# EAGLE design lora-tester (EAGLE 8.4.0)
AUTHOR: Adam Horcica; TITLE: LoRaWAN Tester; VERSION: 0.1
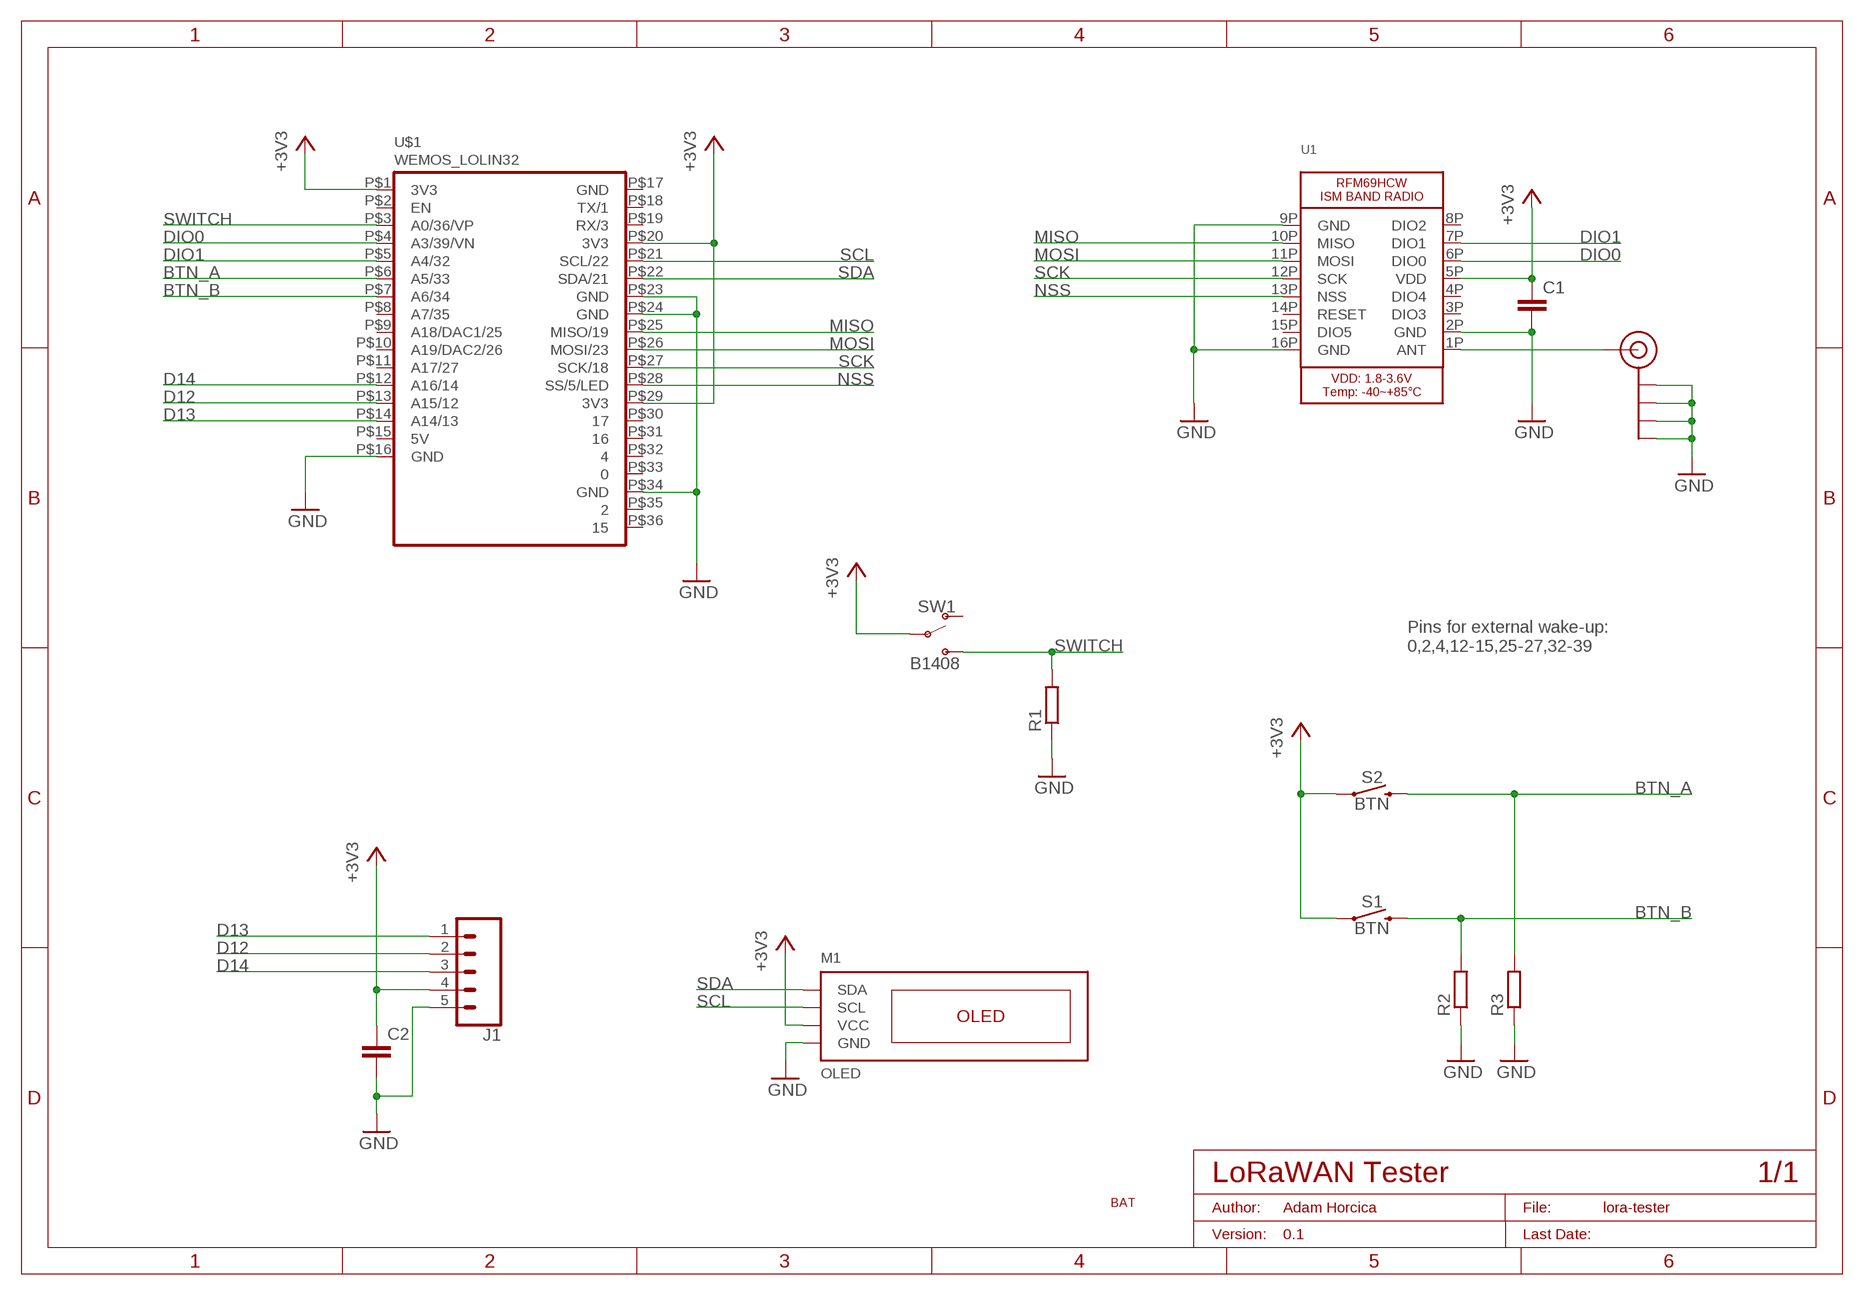
[diagram p0: schematic, sheet 1]

## Parts
BAT  BAT  [BAT]
C1  C-EUC1206  [C1206]
C2  C-EUC1206  [C1206]
J1  CONN_05PTH_LONGPADS  [1X05_LONGPADS]
J$2  SMA_EDGE  [SMA-EDGE]
M1  OLED  [OLED]
R1  R-EU_R0805  [R0805]
R2  R-EU_R0805  [R0805]
R3  R-EU_R0805  [R0805]
S1  BTN  MOMENTARY-SWITCH-SPST-SMD-6.2MM-TALL  [TACTILE_SWITCH_SMD_6.2MM_TALL]
S2  BTN  MOMENTARY-SWITCH-SPST-SMD-6.2MM-TALL  [TACTILE_SWITCH_SMD_6.2MM_TALL]
SW1  B1408  SL19-121P-B1408  [P-B1408]
U1  RFM69HCW_SMT  [RFMHCW_SMT]
U$1  WEMOS_LOLIN32  [WEMOS_LOLIN32]

## Nets
+3V3: C1.1 C2.1 J1.4 M1.VCC S1.A2 S2.A2 SW1.P U1.5P(VDD) U$1.P$1(3V3) U$1.P$20(3V3) U$1.P$29(3V3)
BTN_A: R3.2 S2.B2 U$1.P$6(A5/33)
BTN_B: R2.2 S1.B2 U$1.P$7(A6/34)
D12: J1.2 U$1.P$13(A15/12)
D13: J1.1 U$1.P$14(A14/13)
D14: J1.3 U$1.P$12(A16/14)
DIO0: U1.6P(DIO0) U$1.P$4(A3/39/VN)
DIO1: U1.7P(DIO1) U$1.P$5(A4/32)
GND: C1.2 C2.2 J1.5 J$2.GND@0(GND) J$2.GND@1(GND) J$2.GND@2(GND) J$2.GND@3(GND) M1.GND R1.1 R2.1 R3.1 U1.2P(GND) U1.9P(GND) U1.16P(GND) U$1.P$16(GND) U$1.P$23(GND) U$1.P$24(GND) U$1.P$34(GND)
MISO: U1.10P(MISO) U$1.P$25(MISO/19)
MOSI: U1.11P(MOSI) U$1.P$26(MOSI/23)
N$3: J$2.SIG(SIGNAL) U1.1P(ANT)
NSS: U1.13P(NSS) U$1.P$28(SS/5/LED)
SCK: U1.12P(SCK) U$1.P$27(SCK/18)
SCL: M1.SCL U$1.P$21(SCL/22)
SDA: M1.SDA U$1.P$22(SDA/21)
SWITCH: R1.2 SW1.S U$1.P$3(A0/36/VP)
Unconnected: SW1.O U1.3P(DIO3) U1.4P(DIO4) U1.8P(DIO2) U1.14P(RESET) U1.15P(DIO5) U$1.P$2(EN) U$1.P$8(A7/35) U$1.P$9(A18/DAC1/25) U$1.P$10(A19/DAC2/26) U$1.P$11(A17/27) U$1.P$15(5V) U$1.P$17(GND) U$1.P$18(TX/1) U$1.P$19(RX/3) U$1.P$30 U$1.P$31 U$1.P$32 U$1.P$33 U$1.P$35 U$1.P$36

## Notes on the sheet
- Pins for external wake-up:
  0,2,4,12-15,25-27,32-39

## Library data of the parts
BAT = modules:BAT
C1 C2 = rcl:C-EU: CAPACITOR, European symbol
J1 = modules:CONN_05: Multi connection point. Often used as Generic Header-pin footprint for 0.1 inch spaced/style header connections On any of the 0.1 inch spaced packages, you can populate with these: Break Away Headers - Straight <https://www.sparkfun.com/products/116> (PRT-00116) Break Away Male Headers - Right Angle <https://www.sparkfun.com/products/553> (PRT-00553) Female Headers <https://www.sparkfun.com/products/115> (PRT-00115) Break Away Headers - Machine Pin <https://www.sparkfun.com/products/117> (PRT-00117) Break Away Female Headers - Swiss Machine Pin <https://www.sparkfun.com/products/743> (PRT-00743) For SCREWTERMINALS and SPRING TERMINALS visit here: Screw Terimnals on SparkFun.com <https://www.sparkfun.com/search/results?term=Screw+Terminals> (5mm/3.5mm/2.54mm spacing) This device is also useful as a general connection point to wire up your design to another part of your project. Our various solder wires solder well into these plated through hole pads. Hook-Up Wire - Assortment (Stranded, 22 AWG) <https://www.sparkfun.com/products/11375> (PRT-11375) Hook-Up Wire - Assortment (Solid Core, 22 AWG) <https://www.sparkfun.com/products/11367> (PRT-11367) View the entire wire category on our website here <https://www.sparkfun.com/categories/141> Special notes: Molex polarized connector foot print use with SKU : PRT-08231 with associated crimp pins and housings. 1MM SMD Version SKU: PRT-10208
J$2 = modules:SMA_EDGE: SMA Antenna Connector End launch SMA connector. The paste layer has been removed so that the connector can be hand soldered onto the board after reflow.
M1 = modules:OLED
R1-R3 = rcl:R-EU_: RESISTOR, European symbol
S1 S2 = SparkFun-Switches:MOMENTARY-SWITCH-SPST: Momentary Switch (Pushbutton) - SPST Normally-open (NO) SPST momentary switches (buttons, pushbuttons). Variants PTH-12MM - 12mm square, through-hole Momentary Pushbutton Switch - 12mm Square <https://www.sparkfun.com/products/9190> (COM-09190) PTH-6.0MM, PTH-6.0MM-KIT - 6.0mm square, through-hole Mini Pushbutton Switch <https://www.sparkfun.com/products/97> (COM-00097) KIT package intended for soldering kit's - only one side of pads' copper is exposed. PTH-RIGHT-ANGLE-KIT - Right-angle, through-hole Right Angle Tactile Button <https://www.sparkfun.com/products/10791> - Used on SparkFun BigTime Watch Kit <https://www.sparkfun.com/products/11734> SMD-12MM - 12mm square, surface-mount Tactile Button - SMD (12mm) <https://www.sparkfun.com/products/12993> (COM-12993) Used on SparkFun PicoBoard <https://www.sparkfun.com/products/11888> SMD-4.5MM - 4.5mm Square Trackball Switch Used on SparkFun Blackberry Trackballer Breakout <https://www.sparkfun.com/products/13169> SMD-4.6MMX2.8MM - 4.60mm x 2.80mm, surface mount Used on SparkFun SAMD21 Mini Breakout <https://www.sparkfun.com/products/13664> SMD-5.2MM, SMD-5.2-REDUNDANT - 5.2mm square, surface-mount Mini Pushbutton Switch - SMD <https://www.sparkfun.com/products/8720> (COM-08720) Used on Arduino Pro Mini <https://www.sparkfun.com/products/11114> REDUNDANT package connects both switch circuits together SMD-6.0X3.5MM - 6.0 x 3.5mm, surface mount Momentary Reset Switch SMD <https://www.sparkfun.com/products/8229> (COM-08229) SMD-6.2MM-TALL - 6.2mm square, surface mount Tactile Button - SMD (6mm) <https://www.sparkfun.com/products/12992> Used on SparkFun Digital Sandbox <https://www.sparkfun.com/products/12651> SMD-RIGHT-ANGLE - Right-angle, surface mount Used on SparkFun Block for Intel® Edison - Arduino <https://www.sparkfun.com/products/13036>; PROD_ID: SWCH-11966; SF_SKU: COM-12992
SW1 = modules:SL19-121
U1 = Adafruit RFM+LoRa Breakout:RFM69HCW: RFM69HCW - ISM Band RF Transceiver
U$1 = modules:WEMOS_LOLIN32

## Board
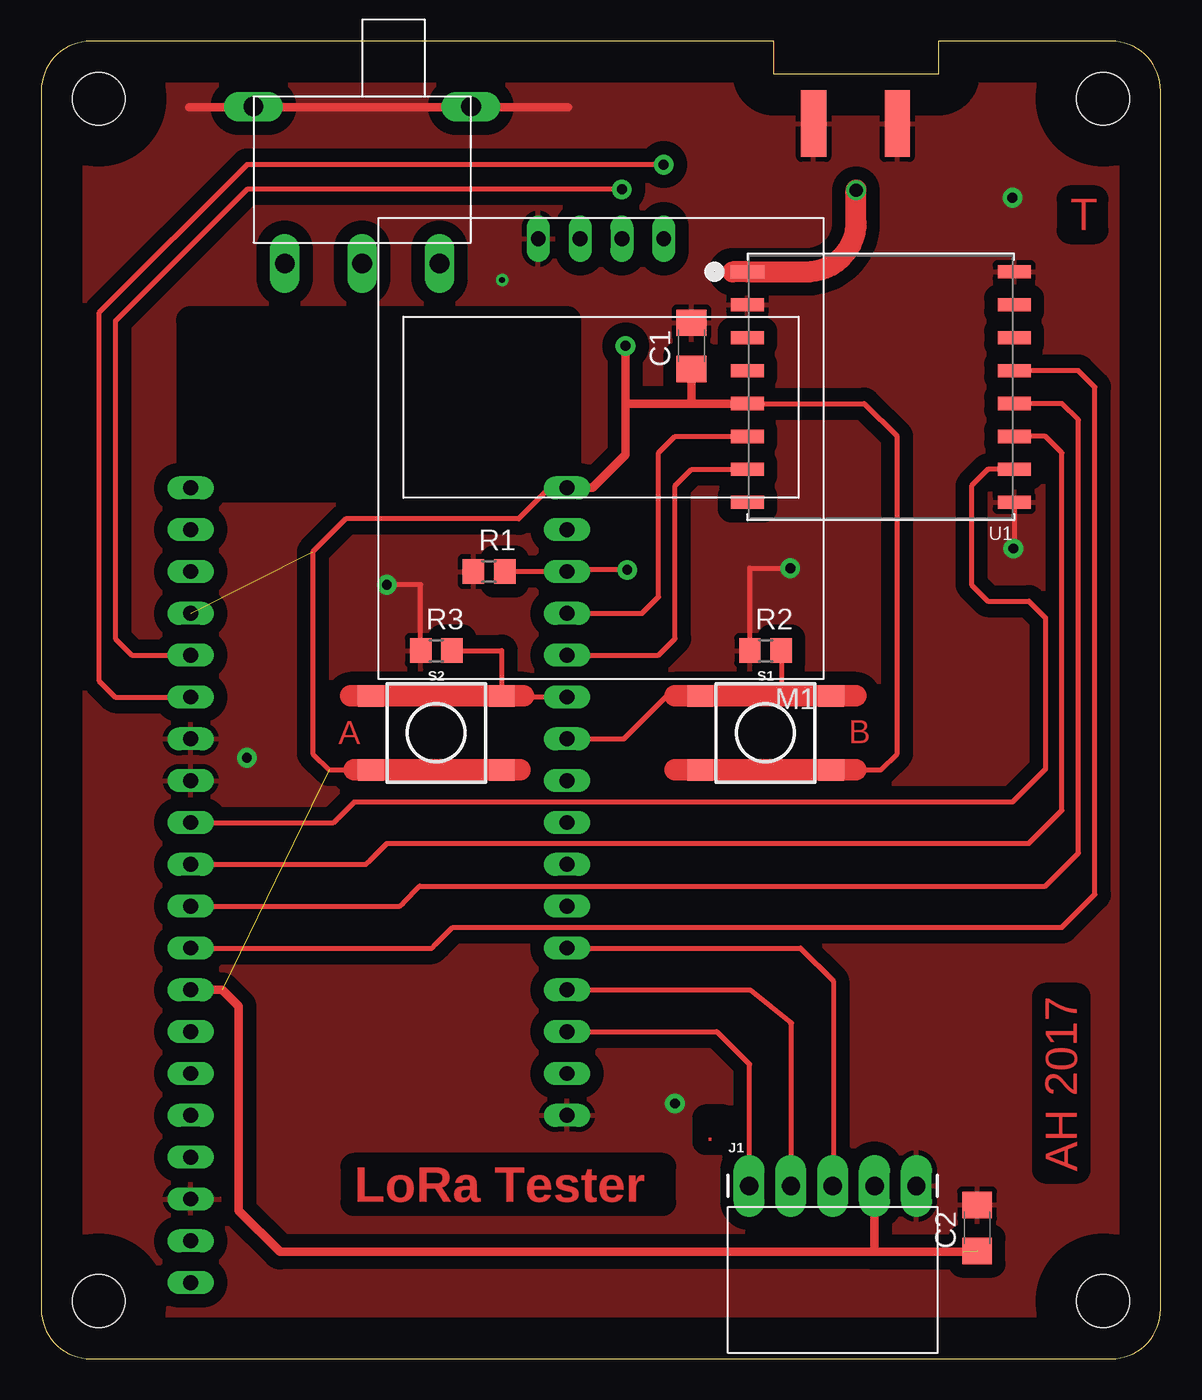
[diagram p1: board, top side]
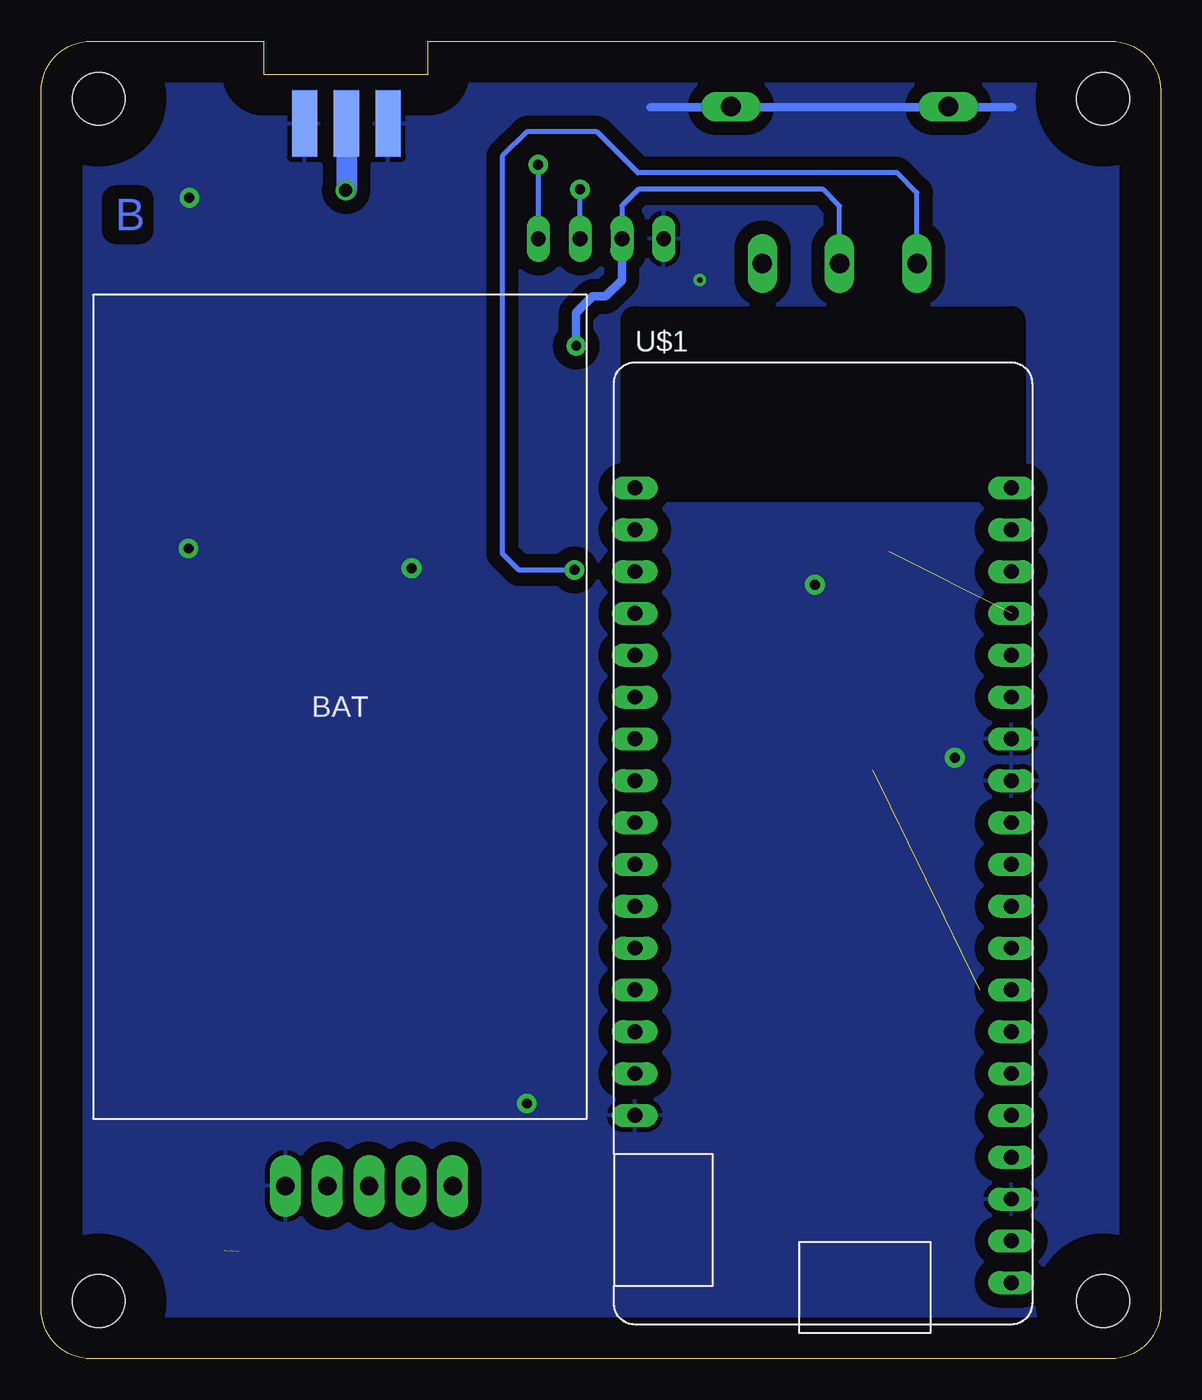
[diagram p2: board, bottom side, seen from below]

Size 68 x 80 mm. Coordinates in mm from the lower left corner, seen from the top.
Outline: 68,3 68,77 arc90 65,80 54.5,80 54.5,78 44.5,78 44.5,80 3,80 arc90 0,77 0,3 arc90 3,0 65,0 arc90 68,3
Copper layers (1*16): Top 0.035mm / dielectric 1.5mm / Bottom 0.035mm
Design rules "default *": minimum track width 6mil, minimum drill 0.35mm, track to track 10mil, track to pad 10mil, pad to pad 10mil, via to via 10mil, smd to smd 10mil, copper to edge 2.5mm, drill to drill 10mil, minimum pad ring 10mil, minimum via ring 8mil, stop-mask expansion 4mil, vias tented up to drill 0mil, thermal gap 0.3mm
Holes 3.2 mm at 3.5,3.5 64.5,3.5 3.5,76.5 64.5,76.5

### Footprints (pad centres in the part's own frame; a part is rotated, then mirrored left to right if it is on the bottom)
C1206 = smd 1.6 x 1.8: 1 -1.4,0; 2 1.4,0
1X05_LONGPADS = drill 1.118 pad 1.88 long: 1 0,0; 2 2.54,0; 3 5.08,0; 4 7.62,0; 5 10.16,0
SMA-EDGE = smd 1.524 x 4.064: GND@0 0,0; GND@1 5.08,0; SIG 2.54,0 | smd 1.524 x 4.064 bottom: GND@2 0,0; GND@3 5.08,0
OLED = drill 0.9 long: GND 3.81,0; SCL -1.27,0; SDA -3.81,0; VCC 1.27,0
R0805 = smd 1.3 x 1.5: 1 -0.95,0; 2 0.95,0
TACTILE_SWITCH_SMD_6.2MM_TALL = smd 1.55 x 1.3: A1 -3.975,-2.25; A2 3.975,-2.25; B1 -3.975,2.25; B2 3.975,2.25
P-B1408 = drill 1.2 long: GND@1 -6.605,-9.53; GND@2 6.605,-9.53; O -4.7,0; P 0,0; S 4.7,0
RFMHCW_SMT = smd 2 x 0.8: 1P 8.1,-7; 2P 8.1,-5; 3P 8.1,-3; 4P 8.1,-1; 5P 8.1,1; 6P 8.1,3; 7P 8.1,5; 8P 8.1,7; 9P -8.1,7; 10P -8.1,5; 11P -8.1,3; 12P -8.1,1; 13P -8.1,-1; 14P -8.1,-3; 15P -8.1,-5; 16P -8.1,-7
WEMOS_LOLIN32 = drill 0.9 long: P$1 -12.7,19.05; P$2 -12.7,16.51; P$3 -12.7,13.97; P$4 -12.7,11.43; P$5 -12.7,8.89; P$6 -12.7,6.35; P$7 -12.7,3.81; P$8 -12.7,1.27; P$9 -12.7,-1.27; P$10 -12.7,-3.81; P$11 -12.7,-6.35; P$12 -12.7,-8.89; P$13 -12.7,-11.43; P$14 -12.7,-13.97; P$15 -12.7,-16.51; P$16 -12.7,-19.05; P$17 10.16,19.05; P$18 10.16,16.51; P$19 10.16,13.97; P$20 10.16,11.43; P$21 10.16,8.89; P$22 10.16,6.35; P$23 10.16,3.81; P$24 10.16,1.27; P$25 10.16,-1.27; P$26 10.16,-3.81; P$27 10.16,-6.35; P$28 10.16,-8.89; P$29 10.16,-11.43; P$30 10.16,-13.97; P$31 10.16,-16.51; P$32 10.16,-19.05; P$33 10.16,-21.59; P$34 10.16,-24.13; P$35 10.16,-26.67; P$36 10.16,-29.21

### Placement (x,y rotation side)
BAT  64.85,14.59 0 bottom
C1  39.5,61.5 90 top
C2  56.85,7.95 90 top
J1  43,10.5 0 top
J$2  52,75 0 bottom
M1  34,68 180 top
R1  27.2,47.8 0 top
R2  44,43 0 top
R3  24,43 0 top
S1  44,38 0 top
S2  24,38 0 top
SW1  19.5,66.5 180 top
U1  51,59 180 top
U$1  19.24,33.83 0 bottom

### Tracks (layer width: path | path; a pad name or v marks a point on that pad's centre or on a via)
+3V3  (via drill 0.6 pad 1.2)  (3 unrouted)
  Top 0.305: 19,35.75 17.5,35.75 16.5,36.75 16.5,49 18.5,51 29,51 30.88,52.88 U$1.P$1 | U1.5P 50,58 52,56 52,36.75 51,35.75 49.15,35.75
  Top 0.508: U$1.P$1 33.5,52.88 35.5,54.88 35.5,58 | 39.5,58 35.5,58 | 39.5,58 U1.5P | C1.1 39.5,58 | 35.5,58 v35.5,61.5 | U$1.P$29 11,22.4 12,21.4 12,9 14.5,6.5 50.5,6.5 | 50.5,6.5 56,6.5 | J1.4 50.62,6.62 50.5,6.5
  Top 1.27: S2.A2 29.1,35.75
  Top 1.3: 29.1,35.75 19,35.75 | 49.5,35.75 49.15,35.75 S1.A2 38.5,35.75
  Bottom 0.305: SW1.P 19.5,70 20.5,71 31.73,71 32.73,70 M1.VCC
  Bottom 0.508: v35.5,61.5 35.5,63.5 34.5,64.5 33.73,64.5 32.73,65.5 M1.VCC
BTN_A
  Top 0.305: 28.05,40.18 arc-90 S2.B2 27.98,43 R3.2 | U$1.P$6 29.3,40.18 29.3,40.25
  Top 1.27: 29.3,40.25 S2.B2
  Top 1.3: 29.3,40.25 18.8,40.25
BTN_B
  Top 0.305: U$1.P$7 35.39,37.64 37,39.25 38,40.25 38.5,40.25 45,40.25 | 45,40.25 S1.B2 | R2.2 44.95,40.25 45,40.25
  Top 1.3: S1.B2 49.5,40.25 38.5,40.25
D12
  Top 0.305: U$1.P$13 43.08,22.4 45.58,20.4 45.54,20.36 J1.2
D13
  Top 0.305: U$1.P$14 41.04,19.86 43.04,17.86 43,17.82 J1.1
D14
  Top 0.305: U$1.P$12 46.12,24.94 48.12,22.94 48.12,10.54 J1.3
DIO0
  Top 0.305: U$1.P$4 36.5,45.26 37.5,46.26 37.5,55 38.5,56 U1.6P
DIO1
  Top 0.305: U$1.P$5 37.5,42.72 38.5,43.72 38.5,53 39.5,54 U1.7P
GND  (via drill 0.35, 0.6 pad 1.2)
  Top 0.305: R3.1 23.05,47 v21,47 | R2.1 43.05,48 v45.5,48 | U1.9P 59.1,49.2 v59.05,49.2
  Top 0.508: 9,76 32,76 | 59.1,70.4 v59,70.5
  Bottom 0.508: 9,76 31,76
  other vias: 38.5,15.5 12.5,36.5 28,65.5
  pour Bottom (isolate 0.813): -2,86 -2,-4 70,-4 70,86
  pour Top (isolate 0.813): -4,84 -4,-2 72,-2 72,84
MISO
  Top 0.305: U1.10P 57.5,54 56.5,53 56.5,47 57.5,46 60,46 61,45 61,35.8 59,33.8 19,33.8 18,32.8 17.76,32.56 U$1.P$25
MOSI
  Top 0.305: U$1.P$26 19.72,30.02 20,30.3 21,31.3 60,31.3 62,33.3 62,55 61,56 U1.11P
N$3  (via drill 0.8)
  Top 1.27: 43,66 46.5,66 arc90 49.5,69 v49.5,70.95 | 43,66 42,66 | U1.1P 43,66
  Bottom 1.27: J$2.SIG 49.46,70.95 v49.5,70.95
NSS
  Top 0.305: U$1.P$28 23.74,24.94 24,25.2 25,26.2 62,26.2 64,28.2 64,59 63,60 U1.13P
SCK
  Top 0.305: U$1.P$27 21.78,27.48 22,27.7 23,28.7 61,28.7 63,30.7 63,57 62,58 U1.12P
SCL  (via drill 0.6 pad 1.2)
  Top 0.305: U$1.P$21 5.5,42.72 4.5,43.72 4.5,63 12.5,71 v35.27,71
  Bottom 0.305: M1.SCL v35.27,71
SDA  (via drill 0.6 pad 1.2)
  Top 0.305: U$1.P$22 4.5,40.18 3.5,41.18 3.5,63.5 12.5,72.5 v37.81,72.5
  Bottom 0.305: v37.81,72.5 M1.SDA
SWITCH  (via drill 0.6 pad 1.2)
  Top 0.305: R1.2 U$1.P$3 31.94,47.9 v35.6,47.9
  Bottom 0.305: v35.6,47.9 39,47.9 40,48.9 40,73 38.5,74.5 34.25,74.5 31.75,72 16,72 14.8,70.8 SW1.S

### Text on the board
Top: T | A | B | AH 2017 | . | LoRa Tester
Bottom: B